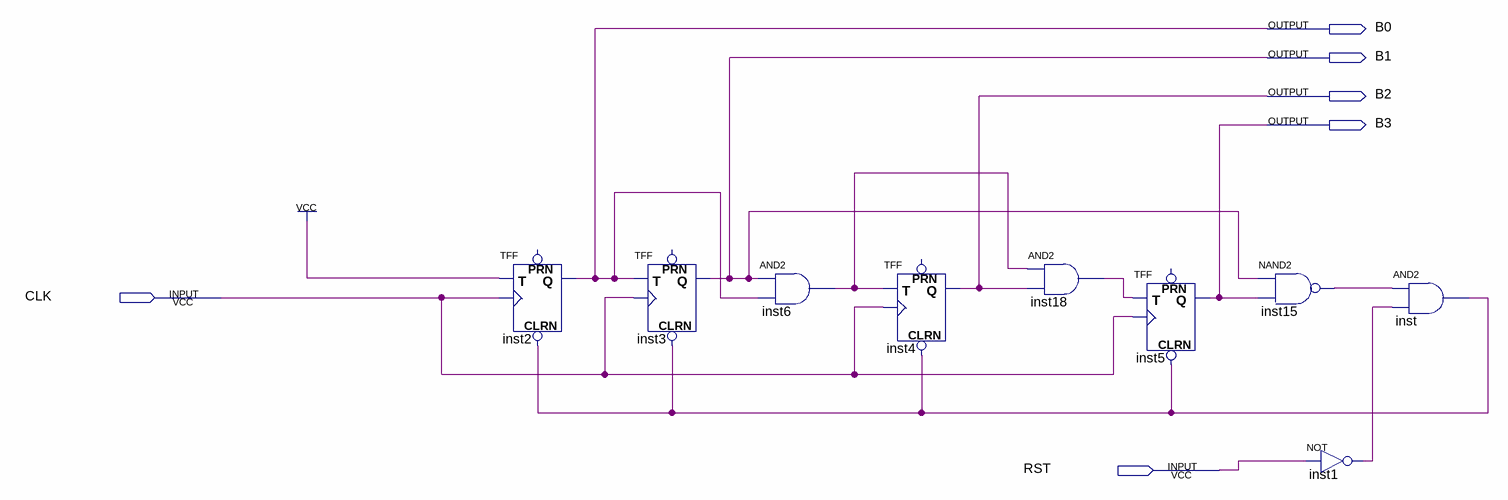
[diagram p0: schematic sheet]
// Quartus schematic counter_mod10.bdf as structural Verilog: 9 symbols, 6 pins
module counter_mod10 (
  input  CLK,
  input  RST,
  output B0,
  output B1,
  output B2,
  output B3
);

  wire inst1_out, inst6_out, inst15_out, inst18_out, inst_out;

  TFF inst2 (.CLRN(inst_out), .T(1'b1), .CLK(CLK), .Q(B0));  // open: PRN
  TFF inst3 (.CLRN(inst_out), .T(B0), .CLK(CLK), .Q(B1));  // open: PRN
  and inst6 (inst6_out, B1, B0);
  TFF inst4 (.CLRN(inst_out), .T(inst6_out), .CLK(CLK), .Q(B2));  // open: PRN
  and inst18 (inst18_out, inst6_out, B2);
  TFF inst5 (.CLRN(inst_out), .T(inst18_out), .CLK(CLK), .Q(B3));  // open: PRN
  nand inst15 (inst15_out, B1, B3);
  not inst1 (inst1_out, RST);
  and inst (inst_out, inst15_out, inst1_out);
endmodule
